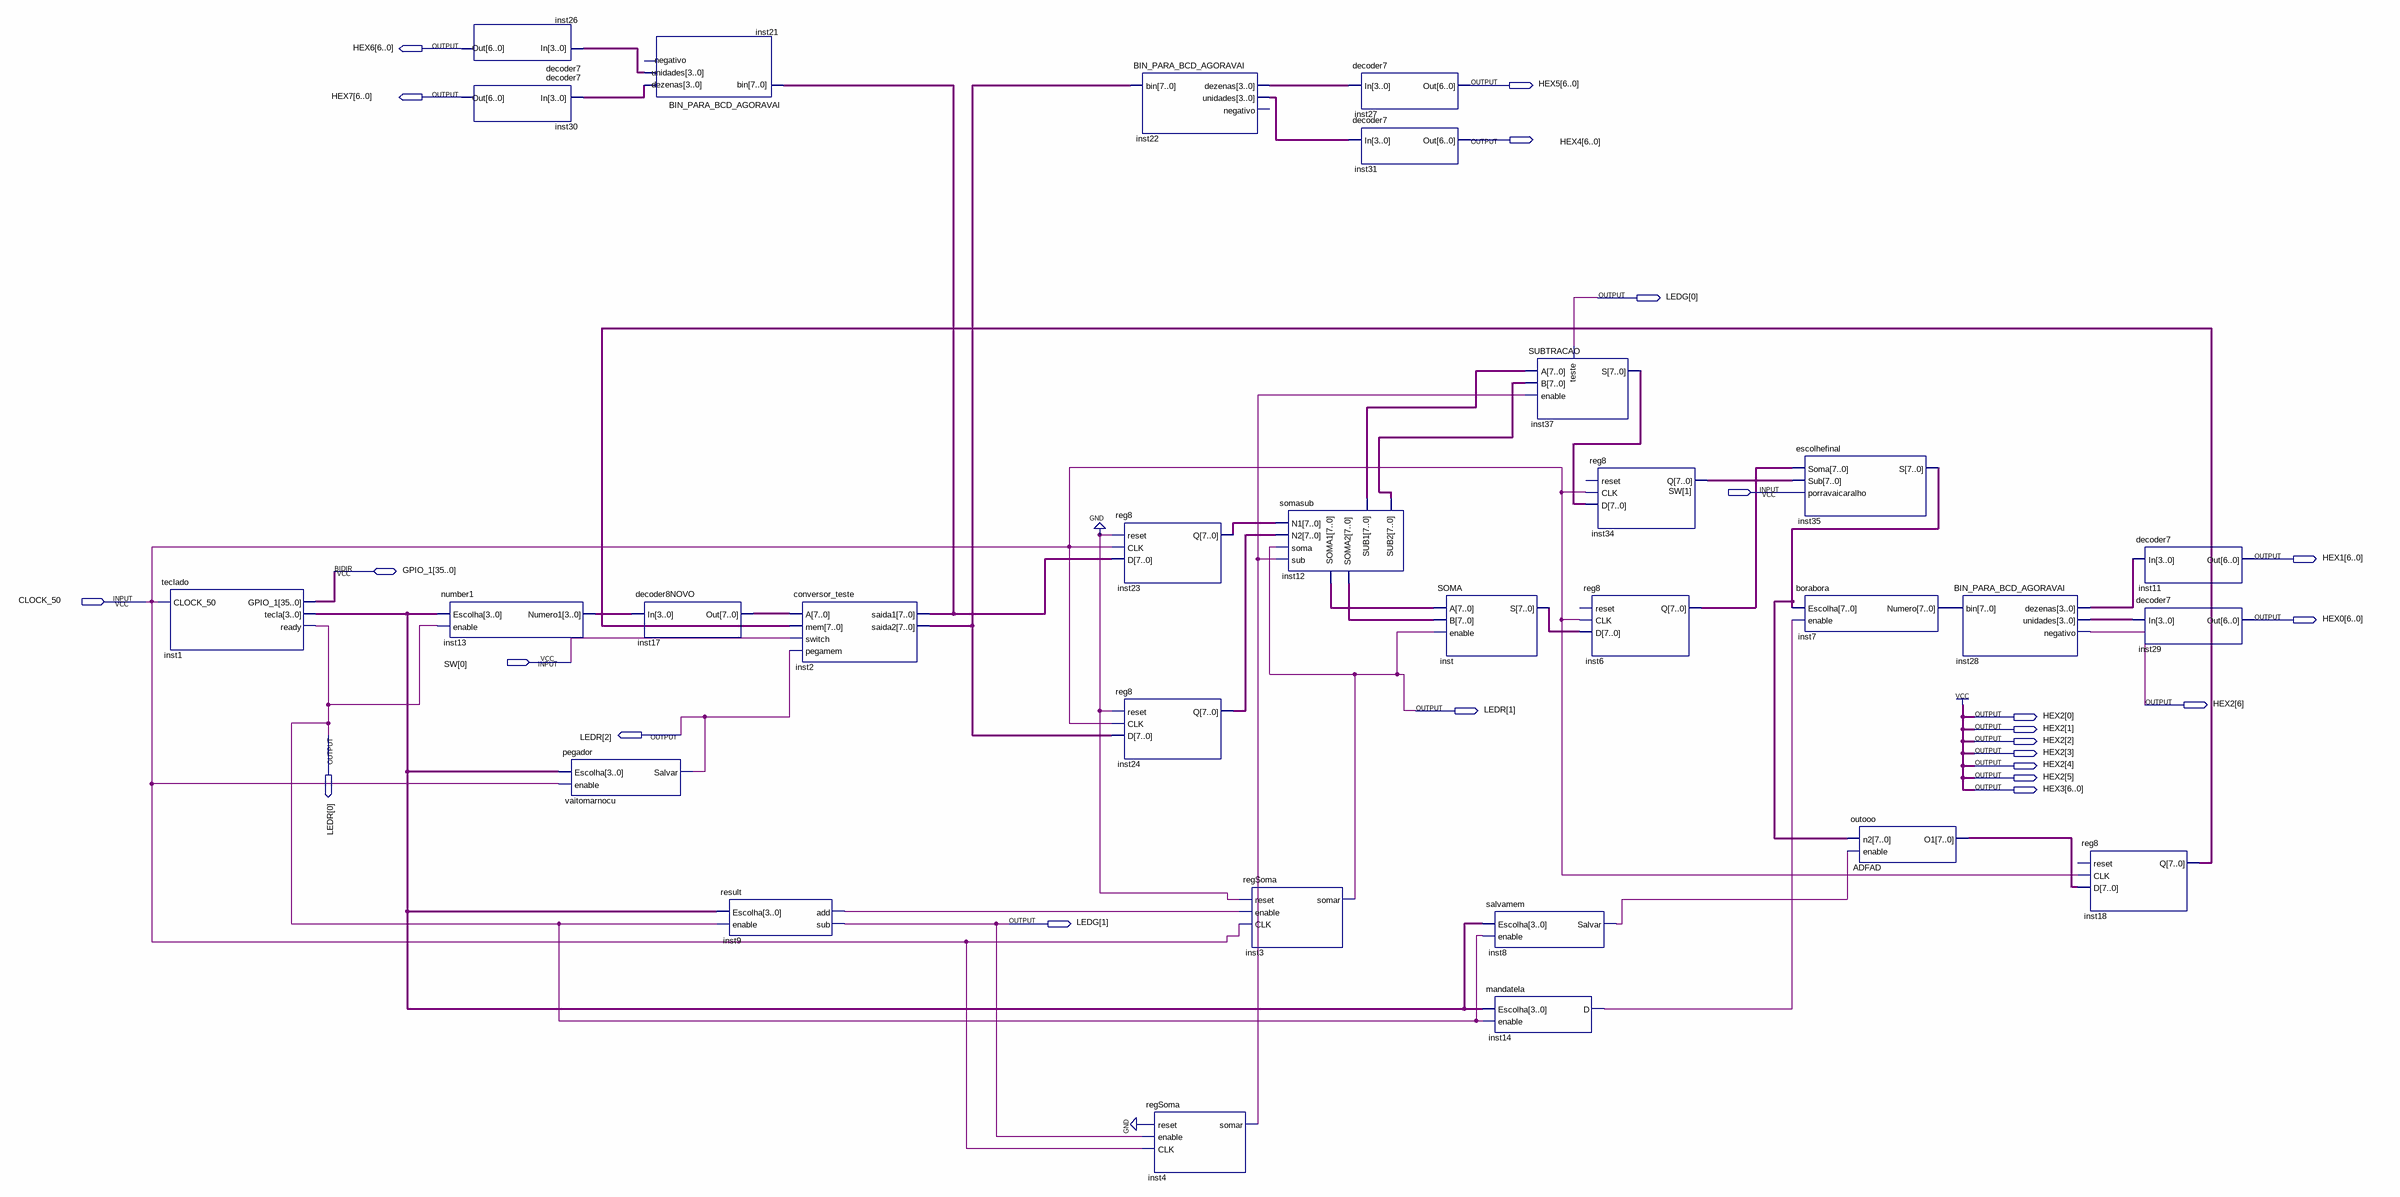
[diagram p0: schematic sheet]
// Quartus schematic poha.bdf as structural Verilog: 30 symbols, 23 pins
module poha (
  input  [1:0] SW,
  input  CLOCK_50,
  inout  [35:0] GPIO_1,
  output [6:0] HEX6,
  output [6:0] HEX5,
  output [6:0] HEX7,
  output [6:0] HEX4,
  output [1:0] LEDG,
  output [6:0] HEX1,
  output [6:0] HEX0,
  output [6:0] HEX2,
  output [2:0] LEDR,
  output [6:0] HEX3
);

  wire inst4_somar, inst8_salvar, inst9_add, inst14_d;
  wire [3:0] inst1_tecla, inst13_numero1, inst21_dezenas, inst21_unidades, inst22_dezenas, inst22_unidades,
       inst28_dezenas, inst28_unidades;
  wire [7:0] ADFAD_o1, inst2_saida1, inst2_saida2, inst6_q, inst7_numero, inst12_soma1, inst12_soma2,
       inst12_sub1, inst12_sub2, inst17_out, inst18_q, inst23_q, inst24_q, inst34_q, inst35_s, inst37_s,
       inst_s;

  teclado inst1 (.CLOCK_50(CLOCK_50), .tecla(inst1_tecla), .ready(LEDR[0]), .GPIO_1(GPIO_1));
  number1 inst13 (.Escolha(inst1_tecla), .enable(LEDR[0]), .Numero1(inst13_numero1));
  decoder7 inst26 (.In(inst21_unidades), .Out(HEX6));
  decoder7 inst30 (.In(inst21_dezenas), .Out(HEX7));
  pegador vaitomarnocu (.Escolha(inst1_tecla), .enable(CLOCK_50), .Salvar(LEDR[2]));
  decoder8NOVO inst17 (.In(inst13_numero1), .Out(inst17_out));
  BIN_PARA_BCD_AGORAVAI inst21 (
    .bin(inst2_saida1), .dezenas(inst21_dezenas), .unidades(inst21_unidades));  // open: negativo
  result inst9 (.Escolha(inst1_tecla), .enable(LEDR[0]), .add(inst9_add), .sub(LEDG[1]));
  conversor_teste inst2 (
    .A(inst17_out), .mem(inst18_q), .switch(SW[0]), .pegamem(LEDR[2]), .saida1(inst2_saida1),
    .saida2(inst2_saida2));
  reg8 inst23 (.reset(1'b0), .CLK(CLOCK_50), .D(inst2_saida1), .Q(inst23_q));
  reg8 inst24 (.reset(1'b0), .CLK(CLOCK_50), .D(inst2_saida2), .Q(inst24_q));
  BIN_PARA_BCD_AGORAVAI inst22 (
    .bin(inst2_saida2), .dezenas(inst22_dezenas), .unidades(inst22_unidades));  // open: negativo
  regSoma inst4 (.reset(1'b0), .enable(LEDG[1]), .CLK(CLOCK_50), .somar(inst4_somar));
  regSoma inst3 (.reset(1'b0), .enable(inst9_add), .CLK(CLOCK_50), .somar(LEDR[1]));
  somasub inst12 (
    .N1(inst23_q), .N2(inst24_q), .soma(LEDR[1]), .sub(inst4_somar), .SOMA1(inst12_soma1),
    .SOMA2(inst12_soma2), .SUB1(inst12_sub1), .SUB2(inst12_sub2));
  decoder7 inst27 (.In(inst22_dezenas), .Out(HEX5));
  decoder7 inst31 (.In(inst22_unidades), .Out(HEX4));
  SOMA inst (.A(inst12_soma1), .B(inst12_soma2), .enable(LEDR[1]), .S(inst_s));
  salvamem inst8 (.Escolha(inst1_tecla), .enable(LEDR[0]), .Salvar(inst8_salvar));
  mandatela inst14 (.Escolha(inst1_tecla), .enable(LEDR[0]), .D(inst14_d));
  SUBTRACAO inst37 (.A(inst12_sub1), .B(inst12_sub2), .enable(inst4_somar), .S(inst37_s), .teste(LEDG[0]));
  reg8 inst34 (.CLK(CLOCK_50), .D(inst37_s), .Q(inst34_q));  // open: reset
  reg8 inst6 (.CLK(CLOCK_50), .D(inst_s), .Q(inst6_q));  // open: reset
  escolhefinal inst35 (.Soma(inst6_q), .Sub(inst34_q), .porravaicaralho(SW[1]), .S(inst35_s));
  borabora inst7 (.Escolha(inst35_s), .enable(inst14_d), .Numero(inst7_numero));
  outooo ADFAD (.n2(inst35_s), .enable(inst8_salvar), .O1(ADFAD_o1));
  BIN_PARA_BCD_AGORAVAI inst28 (
    .bin(inst7_numero), .dezenas(inst28_dezenas), .unidades(inst28_unidades), .negativo(HEX2[6]));
  reg8 inst18 (.CLK(CLOCK_50), .D(ADFAD_o1), .Q(inst18_q));  // open: reset
  decoder7 inst11 (.In(inst28_dezenas), .Out(HEX1));
  decoder7 inst29 (.In(inst28_unidades), .Out(HEX0));

  assign HEX3 = {7{1'b1}};
endmodule
